# EAGLE design MOL-v1.4 (EAGLE 8.2.2)
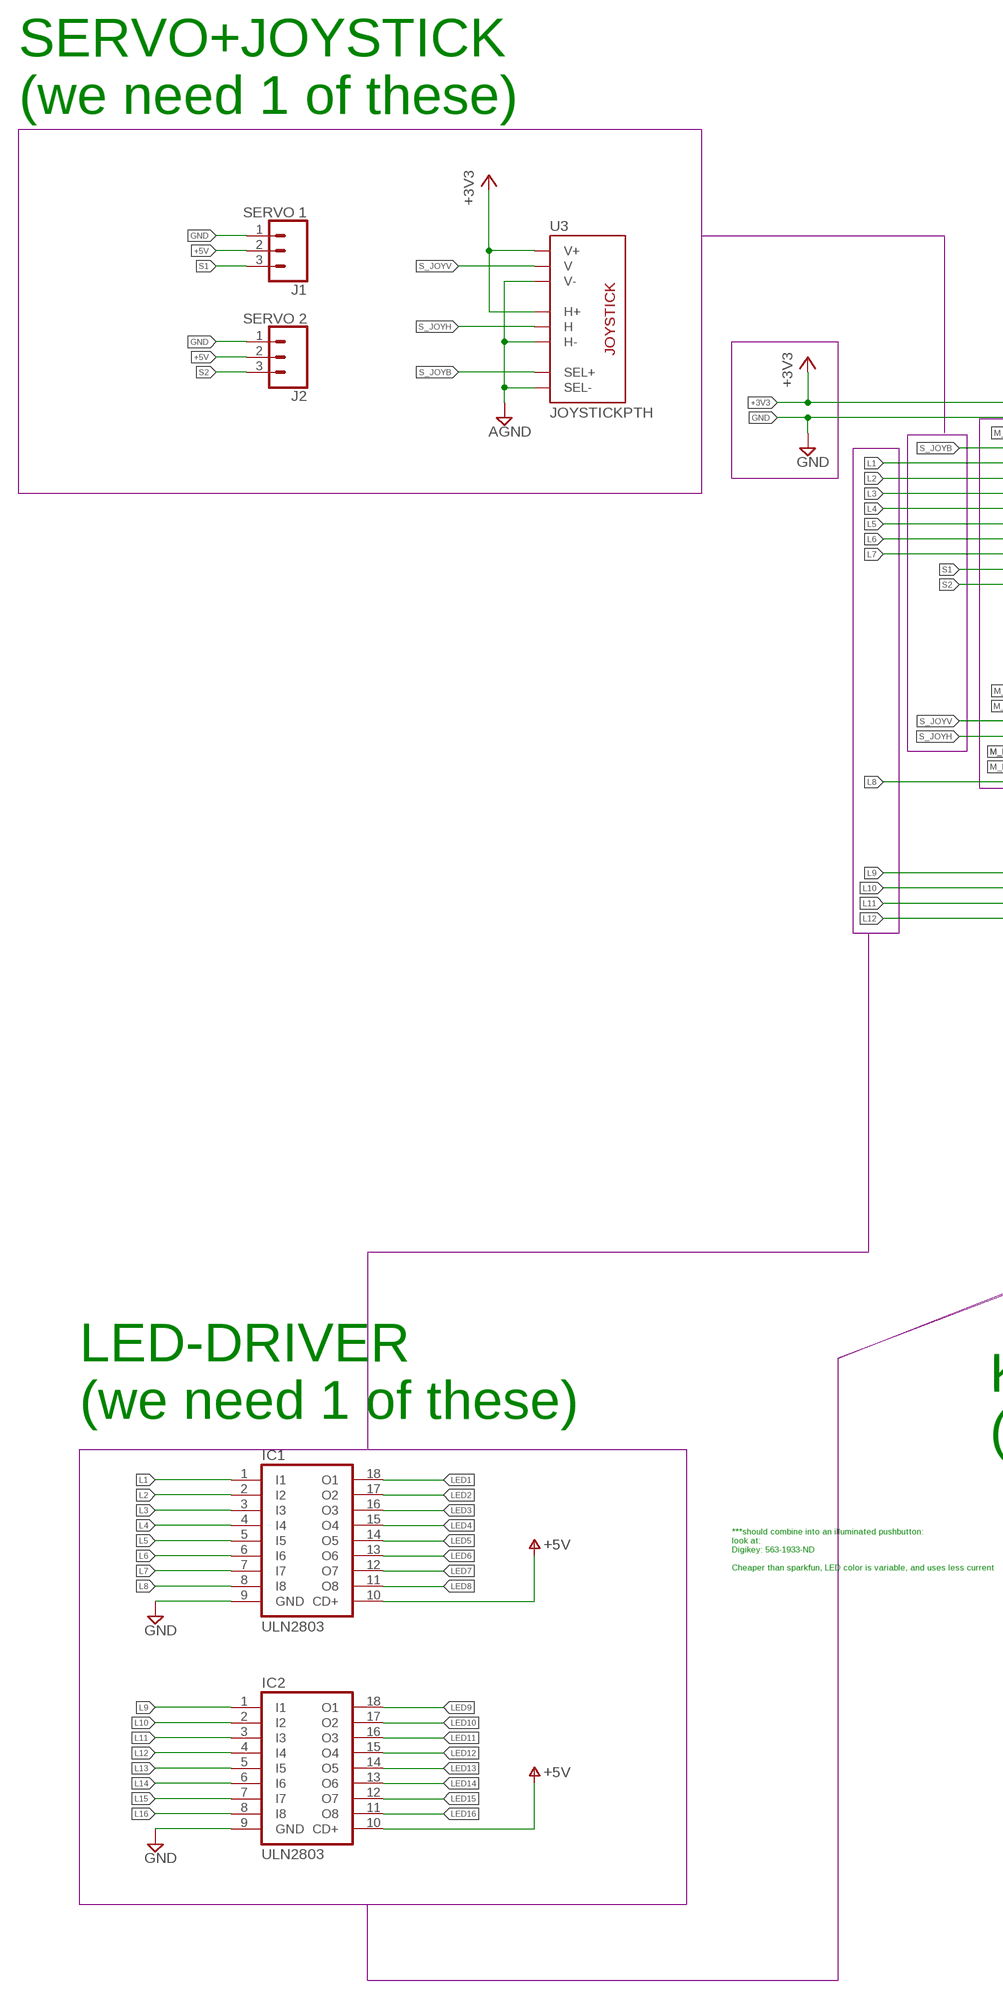
[diagram p0: schematic, sheet 1, part 1 of 2]
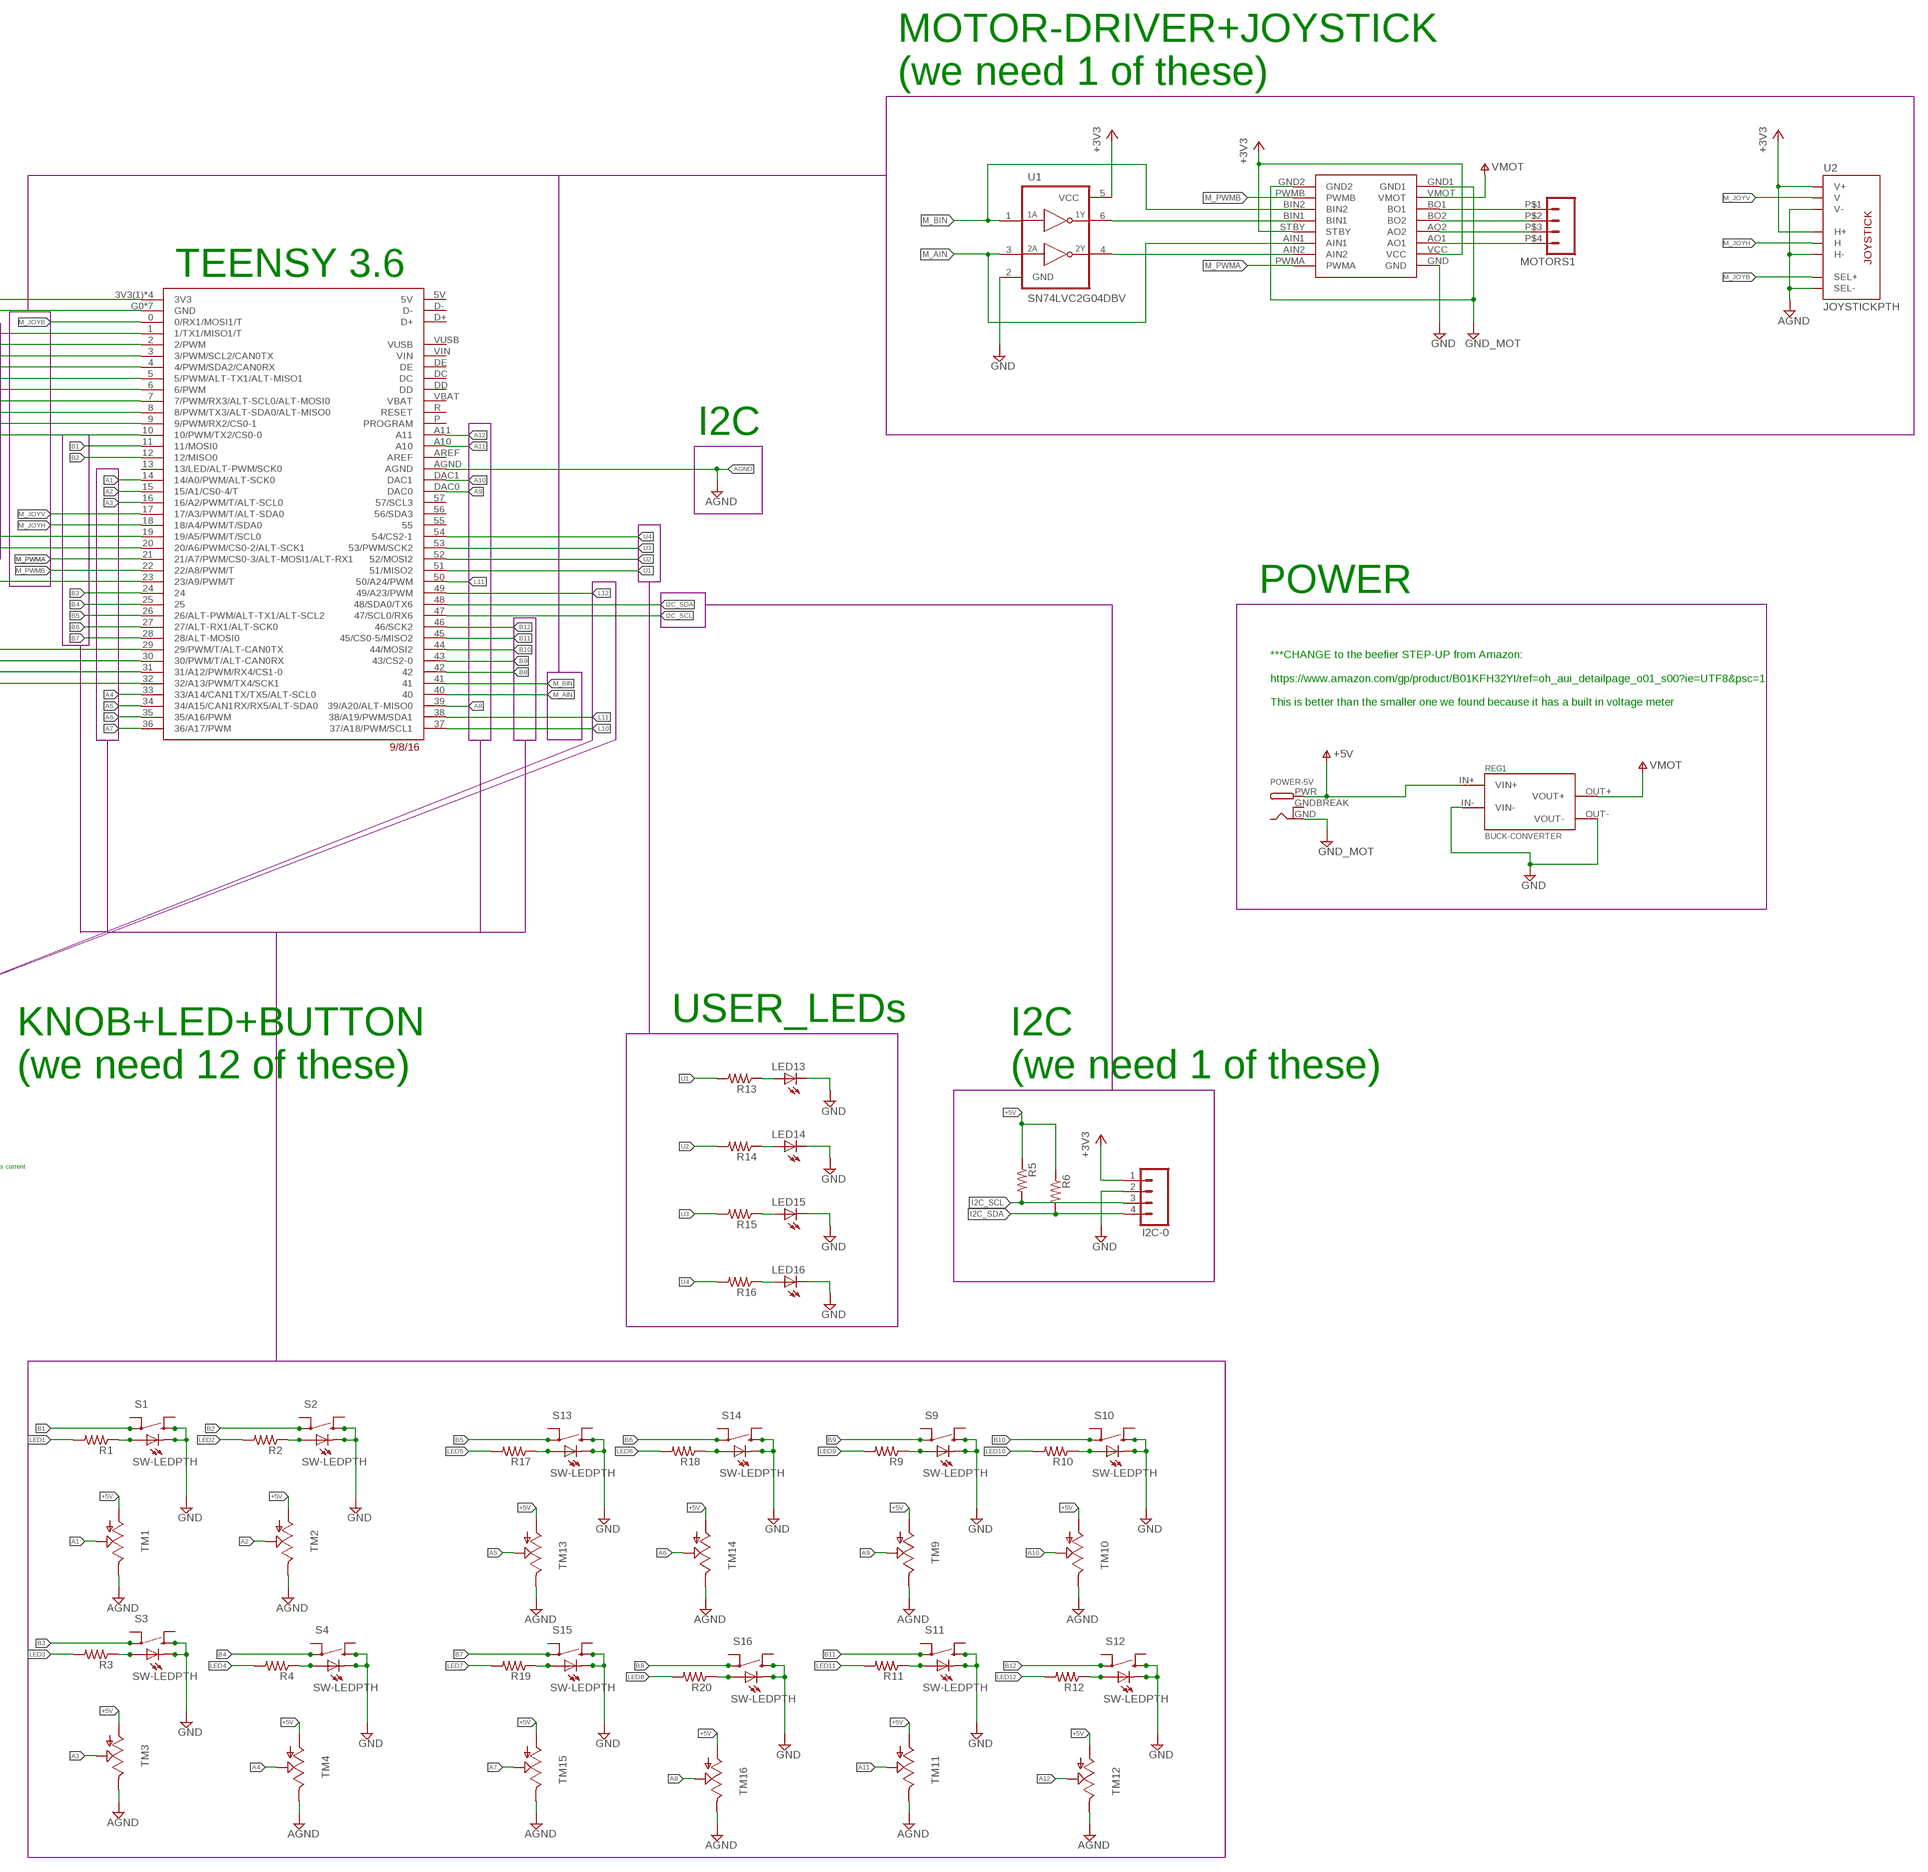
[diagram p1: schematic, sheet 1, part 2 of 2]

## Parts
I2C-0  M04LOCK  [1X04_LOCK]
IC1  ULN2803  ULN2803A  [DIL18]
IC2  ULN2803  ULN2803A  [DIL18]
J1  SERVO 1  CONN_03LOCK  [1X03_LOCK]
J2  SERVO 2  CONN_03LOCK  [1X03_LOCK]
LED13  LED3MM  [LED3MM]
LED14  LED3MM  [LED3MM]
LED15  LED3MM  [LED3MM]
LED16  LED3MM  [LED3MM]
MOTORS1  M04  [SPRINGTERMINAL-2.54MM-4]
POWER-5V  DCBARRELPTH  [DCJACK_2MM_PTH]
R1  R-US_R0603  [R0603]
R2  R-US_R0603  [R0603]
R3  R-US_R0603  [R0603]
R4  R-US_R0603  [R0603]
R5  R-US_R0603  [R0603]
R6  R-US_R0603  [R0603]
R9  R-US_R0603  [R0603]
R10  R-US_R0603  [R0603]
R11  R-US_R0603  [R0603]
R12  R-US_R0603  [R0603]
R13  R-US_R0603  [R0603]
R14  R-US_R0603  [R0603]
R15  R-US_R0603  [R0603]
R16  R-US_R0603  [R0603]
R17  R-US_R0603  [R0603]
R18  R-US_R0603  [R0603]
R19  R-US_R0603  [R0603]
R20  R-US_R0603  [R0603]
REG1  BUCK-CONVERTER  [BUCK-CONVERTER]
S1  SW-LEDPTH  [TR2-SWITCH-MOMENTARY-LED]
S2  SW-LEDPTH  [TR2-SWITCH-MOMENTARY-LED]
S3  SW-LEDPTH  [TR2-SWITCH-MOMENTARY-LED]
S4  SW-LEDPTH  [TR2-SWITCH-MOMENTARY-LED]
S9  SW-LEDPTH  [TR2-SWITCH-MOMENTARY-LED]
S10  SW-LEDPTH  [TR2-SWITCH-MOMENTARY-LED]
S11  SW-LEDPTH  [TR2-SWITCH-MOMENTARY-LED]
S12  SW-LEDPTH  [TR2-SWITCH-MOMENTARY-LED]
S13  SW-LEDPTH  [TR2-SWITCH-MOMENTARY-LED]
S14  SW-LEDPTH  [TR2-SWITCH-MOMENTARY-LED]
S15  SW-LEDPTH  [TR2-SWITCH-MOMENTARY-LED]
S16  SW-LEDPTH  [TR2-SWITCH-MOMENTARY-LED]
TM1  TRIM  [TRIM-PCB-9MM]
TM2  TRIM  [TRIM-PCB-9MM]
TM3  TRIM  [TRIM-PCB-9MM]
TM4  TRIM  [TRIM-PCB-9MM]
TM9  TRIM  [TRIM-PCB-9MM]
TM10  TRIM  [TRIM-PCB-9MM]
TM11  TRIM  [TRIM-PCB-9MM]
TM12  TRIM  [TRIM-PCB-9MM]
TM13  TRIM  [TRIM-PCB-9MM]
TM14  TRIM  [TRIM-PCB-9MM]
TM15  TRIM  [TRIM-PCB-9MM]
TM16  TRIM  [TRIM-PCB-9MM]
U1  SN74LVC2G04DBV  [SOT23-6]
U2  JOYSTICKPTH  [JOYSTICK]
U3  JOYSTICKPTH  [JOYSTICK]
U$1  TEENSY3_6--ALLPINS  [T36]
U$7  POLOLU_TB6612FNG  [POLOLU_TB6612FNG]

## Nets
+3V3: I2C-0.1 U1.5(VCC) U2.H1(H+) U2.V1(V+) U3.H1(H+) U3.V1(V+) U$1.3V3(1)(3V3) U$1.3V3(2)(3V3) U$1.3V3(3)(3V3) U$1.3V3(4)(3V3) U$7.STBY U$7.VCC
+5V [Power]: IC1.10(CD+) IC2.10(CD+) J1.2 J2.2 POWER-5V.PWR R5.1 R6.1 REG1.IN+(VIN+) TM1.1(A) TM2.1(A) TM3.1(A) TM4.1(A) TM9.1(A) TM10.1(A) TM11.1(A) TM12.1(A) TM13.1(A) TM14.1(A) TM15.1(A) TM16.1(A) ; supply symbol labelled V+
A1: TM1.2(S) U$1.14(14/A0/PWM/ALT-SCK0)
A2: TM2.2(S) U$1.15(15/A1/CS0-4/T)
A3: TM3.2(S) U$1.16(16/A2/PWM/T/ALT-SCL0)
A4: TM4.2(S) U$1.33(33/A14/CAN1TX/TX5/ALT-SCL0)
A5: TM13.2(S) U$1.34(34/A15/CAN1RX/RX5/ALT-SDA0)
A6: TM14.2(S) U$1.35(35/A16/PWM)
A7: TM15.2(S) U$1.36(36/A17/PWM)
A8: TM16.2(S) U$1.39(39/A20/ALT-MISO0)
A9: TM9.2(S) U$1.DAC0
A10: TM10.2(S) U$1.DAC1
A11: TM11.2(S) U$1.A10
A12: TM12.2(S) U$1.A11
AGND: TM1.3(E) TM2.3(E) TM3.3(E) TM4.3(E) TM9.3(E) TM10.3(E) TM11.3(E) TM12.3(E) TM13.3(E) TM14.3(E) TM15.3(E) TM16.3(E) U2.B2A(SEL-) U2.H3(H-) U2.V3(V-) U3.B2A(SEL-) U3.H3(H-) U3.V3(V-) U$1.AGND
B1: S1.3 U$1.11(11/MOSI0)
B2: S2.3 U$1.12(12/MISO0)
B3: S3.3 U$1.24
B4: S4.3 U$1.25
B5: S13.3 U$1.26(26/ALT-PWM/ALT-TX1/ALT-SCL2)
B6: S14.3 U$1.27(27/ALT-RX1/ALT-SCK0)
B7: S15.3 U$1.28(28/ALT-MOSI0)
B8: S16.3 U$1.42
B9: S9.3 U$1.43(43/CS2-0)
B10: S10.3 U$1.44(44/MOSI2)
B11: S11.3 U$1.45(45/CS0-5/MISO2)
B12: S12.3 U$1.46(46/SCK2)
GND: I2C-0.2 IC1.9(GND) IC2.9(GND) J1.1 J2.1 LED13.K(C) LED14.K(C) LED15.K(C) LED16.K(C) REG1.IN-(VIN-) REG1.OUT-(VOUT-) S1.1 S1.C S2.1 S2.C S3.1 S3.C S4.1 S4.C S9.1 S9.C S10.1 S10.C S11.1 S11.C S12.1 S12.C S13.1 S13.C S14.1 S14.C S15.1 S15.C S16.1 S16.C U1.2(GND) U$1.G0(GND) U$1.G1(GND) U$1.G2(GND) U$1.G3(GND) U$1.G4(GND) U$1.G5(GND) U$1.G6(GND) U$7.GND
GND_MOT [Power]: POWER-5V.GND U$7.GND1 U$7.GND2
I2C_SCL: I2C-0.3 R5.2 U$1.47(47/SCL0/RX6)
I2C_SDA: I2C-0.4 R6.2 U$1.48(48/SDA0/TX6)
L1: IC1.1(I1) U$1.2(2/PWM)
L2: IC1.2(I2) U$1.3(3/PWM/SCL2/CAN0TX)
L3: IC1.3(I3) U$1.4(4/PWM/SDA2/CAN0RX)
L4: IC1.4(I4) U$1.5(5/PWM/ALT-TX1/ALT-MISO1)
L5: IC1.5(I5) U$1.6(6/PWM)
L6: IC1.6(I6) U$1.7(7/PWM/RX3/ALT-SCL0/ALT-MOSI0)
L7: IC1.7(I7) U$1.8(8/PWM/TX3/ALT-SDA0/ALT-MISO0)
L8: IC1.8(I8) U$1.23(23/A9/PWM/T)
L9: IC2.1(I1) U$1.29(29/PWM/T/ALT-CAN0TX)
L10: IC2.2(I2) U$1.30(30/PWM/T/ALT-CAN0RX) U$1.37(37/A18/PWM/SCL1)
L11: IC2.3(I3) U$1.31(31/A12/PWM/RX4/CS1-0) U$1.38(38/A19/PWM/SDA1) U$1.50(50/A24/PWM)
L12: IC2.4(I4) U$1.32(32/A13/PWM/TX4/SCK1) U$1.49(49/A23/PWM)
L13: IC2.5(I5)
L14: IC2.6(I6)
L15: IC2.7(I7)
L16: IC2.8(I8)
LED1: IC1.18(O1) R1.2
LED2: IC1.17(O2) R2.2
LED3: IC1.16(O3) R3.2
LED4: IC1.15(O4) R4.2
LED5: IC1.14(O5) R17.2
LED6: IC1.13(O6) R18.2
LED7: IC1.12(O7) R19.2
LED8: IC1.11(O8) R20.2
LED9: IC2.18(O1) R9.2
LED10: IC2.17(O2) R10.2
LED11: IC2.16(O3) R11.2
LED12: IC2.15(O4) R12.2
LED13: IC2.14(O5)
LED14: IC2.13(O6)
LED15: IC2.12(O7)
LED16: IC2.11(O8)
M_AIN: U1.3(2A) U$1.40 U$7.AIN1
M_BIN: U1.1(1A) U$1.41 U$7.BIN2
M_JOYB: U2.B1A(SEL+) U$1.0(0/RX1/MOSI1/T)
M_JOYH: U2.H2(H) U$1.18(18/A4/PWM/T/SDA0)
M_JOYV: U2.V2(V) U$1.17(17/A3/PWM/T/ALT-SDA0)
M_PWMA: U$1.21(21/A7/PWM/CS0-3/ALT-MOSI1/ALT-RX1) U$7.PWMA
M_PWMB: U$1.22(22/A8/PWM/T) U$7.PWMB
N$1: R1.1 S1.A
N$2: LED13.A R13.1
N$3: LED14.A R14.1
N$4: LED15.A R15.1
N$5: U1.6(1Y) U$7.BIN1
N$6: U1.4(2Y) U$7.AIN2
N$7: LED16.A R16.1
N$8: R2.1 S2.A
N$9: R3.1 S3.A
N$10: R4.1 S4.A
N$15: R9.1 S9.A
N$16: R10.1 S10.A
N$17: R11.1 S11.A
N$18: R12.1 S12.A
N$19: R17.1 S13.A
N$20: R18.1 S14.A
N$21: R19.1 S15.A
N$22: R20.1 S16.A
N$45 [Power]: MOTORS1.P$1 U$7.BO1
N$46 [Power]: MOTORS1.P$2 U$7.BO2
N$52 [Power]: MOTORS1.P$3 U$7.AO2
N$54 [Power]: MOTORS1.P$4 U$7.AO1
S1: J1.3 U$1.9(9/PWM/RX2/CS0-1)
S2: J2.3 U$1.10(10/PWM/TX2/CS0-0)
S_JOYB: U3.B1A(SEL+) U$1.1(1/TX1/MISO1/T)
S_JOYH: U3.H2(H) U$1.20(20/A6/PWM/CS0-2/ALT-SCK1)
S_JOYV: U3.V2(V) U$1.19(19/A5/PWM/T/SCL0)
U1: R13.2 U$1.51(51/MISO2)
U2: R14.2 U$1.52(52/MOSI2)
U3: R15.2 U$1.53(53/PWM/SCK2)
U4: R16.2 U$1.54(54/CS2-1)
VMOT [Power]: REG1.OUT+(VOUT+) U$7.VMOT ; supply symbol labelled V+
Unconnected: S1.2 S1.4 S2.2 S2.4 S3.2 S3.4 S4.2 S4.4 S9.2 S9.4 S10.2 S10.4 S11.2 S11.4 S12.2 S12.4 S13.2 S13.4 S14.2 S14.4 S15.2 S15.4 S16.2 S16.4 U$1.5V U$1.13(13/LED/ALT-PWM/SCK0) U$1.55 U$1.56(56/SDA3) U$1.57(57/SCL3) U$1.AREF U$1.D+ U$1.D- U$1.DC U$1.DD U$1.DE U$1.P(PROGRAM) U$1.R(RESET) U$1.VBAT U$1.VIN U$1.VUSB

## Notes on the sheet
- SERVO+JOYSTICK
  (we need 1 of these)
- MOTOR-DRIVER+JOYSTICK
  (we need 1 of these)
- TEENSY 3.6
- I2C
- POWER
- ***CHANGE to the beefier STEP-UP from Amazon:
  
  https://www.amazon.com/gp/product/B01KFH32YI/ref=oh_aui_detailpage_o01_s00?ie=UTF8&psc=1
  
  This is better than the smaller one we found because it has a built in voltage meter
- USER_LEDs
- LED-DRIVER
  (we need 1 of these)
- KNOB+LED+BUTTON
  (we need 12 of these)
- I2C
  (we need 1 of these)
- ***should combine into an illuminated pushbutton:
  look at:
  Digikey: 563-1933-ND
  
  Cheaper than sparkfun, LED color is variable, and uses less current

## Power pins joined to a net without a drawn wire
GNDBREAK: POWER-5V.GNDBREAK

## Library data of the parts
I2C-0 MOTORS1 = CMU-ArtFab:M04: Header 4 Standard 4-pin 0.1" header. Use with straight break away headers (SKU : PRT-00116), right angle break away headers (PRT-00553), swiss pins (PRT-00743), machine pins (PRT-00117), and female headers (PRT-00115). Molex polarized connector foot print use with SKU : PRT-08231 with associated crimp pins and housings. 1MM SMD Version SKU: PRT-10208
IC1 IC2 = uln-udn:ULN2803A: DRIVER ARRAY
J1 J2 = SparkFun-Connectors:CONN_03: Multi connection point. Often used as Generic Header-pin footprint for 0.1 inch spaced/style header connections On any of the 0.1 inch spaced packages, you can populate with these: Break Away Headers - Straight <https://www.sparkfun.com/products/116> (PRT-00116) Break Away Male Headers - Right Angle <https://www.sparkfun.com/products/553> (PRT-00553) Female Headers <https://www.sparkfun.com/products/115> (PRT-00115) Break Away Headers - Machine Pin <https://www.sparkfun.com/products/117> (PRT-00117) Break Away Female Headers - Swiss Machine Pin <https://www.sparkfun.com/products/743> (PRT-00743) Stackable Header - 3 Pin (Female, 0.1") <https://www.sparkfun.com/products/13875> (PRT-13875) For SCREWTERMINALS and SPRING TERMINALS visit here: Screw Terimnals on SparkFun.com <https://www.sparkfun.com/search/results?term=Screw+Terminals> (5mm/3.5mm/2.54mm spacing) This device is also useful as a general connection point to wire up your design to another part of your project. Our various solder wires solder well into these plated through hole pads. Hook-Up Wire - Assortment (Stranded, 22 AWG) <https://www.sparkfun.com/products/11375> (PRT-11375) Hook-Up Wire - Assortment (Solid Core, 22 AWG) <https://www.sparkfun.com/products/11367> (PRT-11367) View the entire wire category on our website here <https://www.sparkfun.com/categories/141> Special notes: Molex polarized connector foot print use with SKU : PRT-08232 with associated crimp pins and housings.
LED13-LED16 = led:LED: LED OSRAM: - CHIPLED LG R971, LG N971, LY N971, LG Q971, LY Q971, LO R971, LY R971 LH N974, LH R974 LS Q976, LO Q976, LY Q976 LO Q996 - Hyper CHIPLED LW Q18S LB Q993, LB Q99A, LB R99A - SideLED LS A670, LO A670, LY A670, LG A670, LP A670 LB A673, LV A673, LT A673, LW A673 LH A674 LY A675 LS A676, LA A676, LO A676, LY A676, LW A676 LS A679, LY A679, LG A679 - Hyper Micro SIDELED® LS Y876, LA Y876, LO Y876, LY Y876 LT Y87S - SmartLED LW L88C, LW L88S LB L89C, LB L89S, LG L890 LS L89K, LO L89K, LY L89K LS L896, LA L896, LO L896, LY L896 - TOPLED LS T670, LO T670, LY T670, LG T670, LP T670 LSG T670, LSP T670, LSY T670, LOP T670, LYG T670 LG T671, LOG T671, LSG T671 LB T673, LV T673, LT T673, LW T673 LH T674 LS T676, LA T676, LO T676, LY T676, LB T676, LH T676, LSB T676, LW T676 LB T67C, LV T67C, LT T67C, LS T67K, LO T67K, LY T67K, LW E67C LS E67B, LA E67B, LO E67B, LY E67B, LB E67C, LV E67C, LT E67C LW T67C LS T679, LY T679, LG T679 LS T770, LO T770, LY T770, LG T770, LP T770 LB T773, LV T773, LT T773, LW T773 LH T774 LS E675, LA E675, LY E675, LS T675 LS T776, LA T776, LO T776, LY T776, LB T776 LHGB T686 LT T68C, LB T68C - Hyper Mini TOPLED® LB M676 - Mini TOPLED Santana® LG M470 LS M47K, LO M47K, LY M47K Source: http://www.osram.convergy.de LUXEON: - LUMILED® LXK2-PW12-R00, LXK2-PW12-S00, LXK2-PW14-U00, LXK2-PW14-V00 LXK2-PM12-R00, LXK2-PM12-S00, LXK2-PM14-U00 LXK2-PE12-Q00, LXK2-PE12-R00, LXK2-PE12-S00, LXK2-PE14-T00, LXK2-PE14-U00 LXK2-PB12-K00, LXK2-PB12-L00, LXK2-PB12-M00, LXK2-PB14-N00, LXK2-PB14-P00, LXK2-PB14-Q00 LXK2-PR12-L00, LXK2-PR12-M00, LXK2-PR14-Q00, LXK2-PR14-R00 LXK2-PD12-Q00, LXK2-PD12-R00, LXK2-PD12-S00 LXK2-PH12-R00, LXK2-PH12-S00 LXK2-PL12-P00, LXK2-PL12-Q00, LXK2-PL12-R00 Source: www.luxeon.com KINGBRIGHT: KA-3528ASYC Source: www.kingbright.com
POWER-5V = adafruit:DCBARREL: 2.0mm DC Barrel Jack DCJACK_2MM_PTH - Through Hole Jack (4UConnector: 05537)
R1-R6 R9-R20 = CMU-ArtFab:R-US_: RESISTOR, American symbol
REG1 = Daniel:BUCK-CONVERTER
S1-S4 S9-S16 = Daniel:SW-LED: SWITCH PUSH SPST-NO 10MA 12V
TM1-TM4 TM9-TM16 = Daniel:TRIM
U1 = 74LV:SN74LVC2G04: DUAL INVERTER GATE
U2 U3 = adafruit:JOYSTICK: Thumb Joystick Joystick commonly found in PS2 controllers. Two pots and a select switch. Adapted from Sparkfun Library (but for more common 6mm switch sticks)
U$1 = Teensy_3_6:TEENSY3_6--ALLPINS
U$7 = CMU-ArtFab:POLOLU_TB6612FNG

## Net classes
2 Power: width 0.508 mm, clearance 0.152 mm

## Board
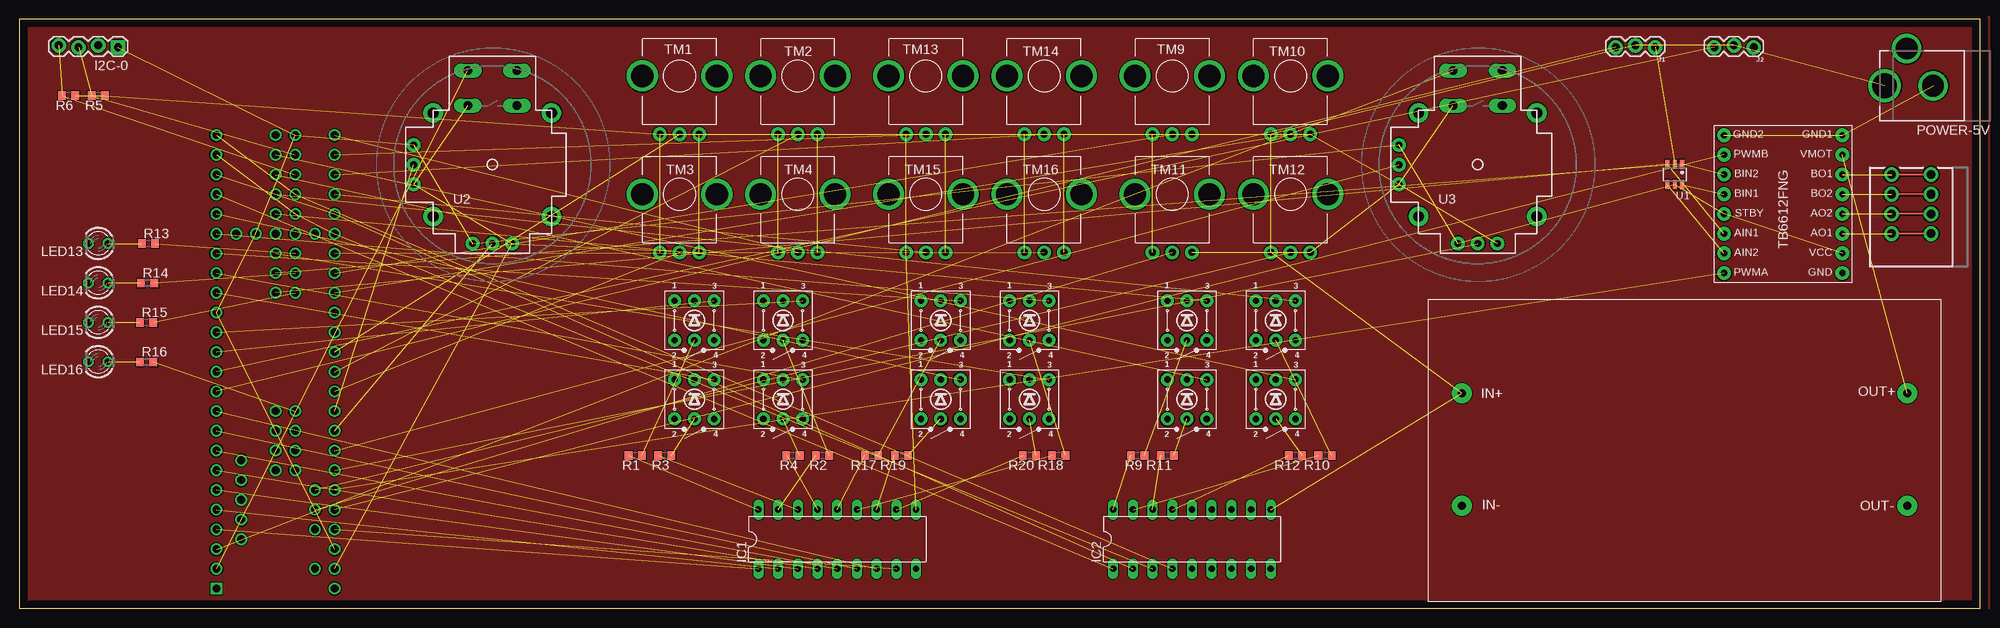
[diagram p2: board, top side]
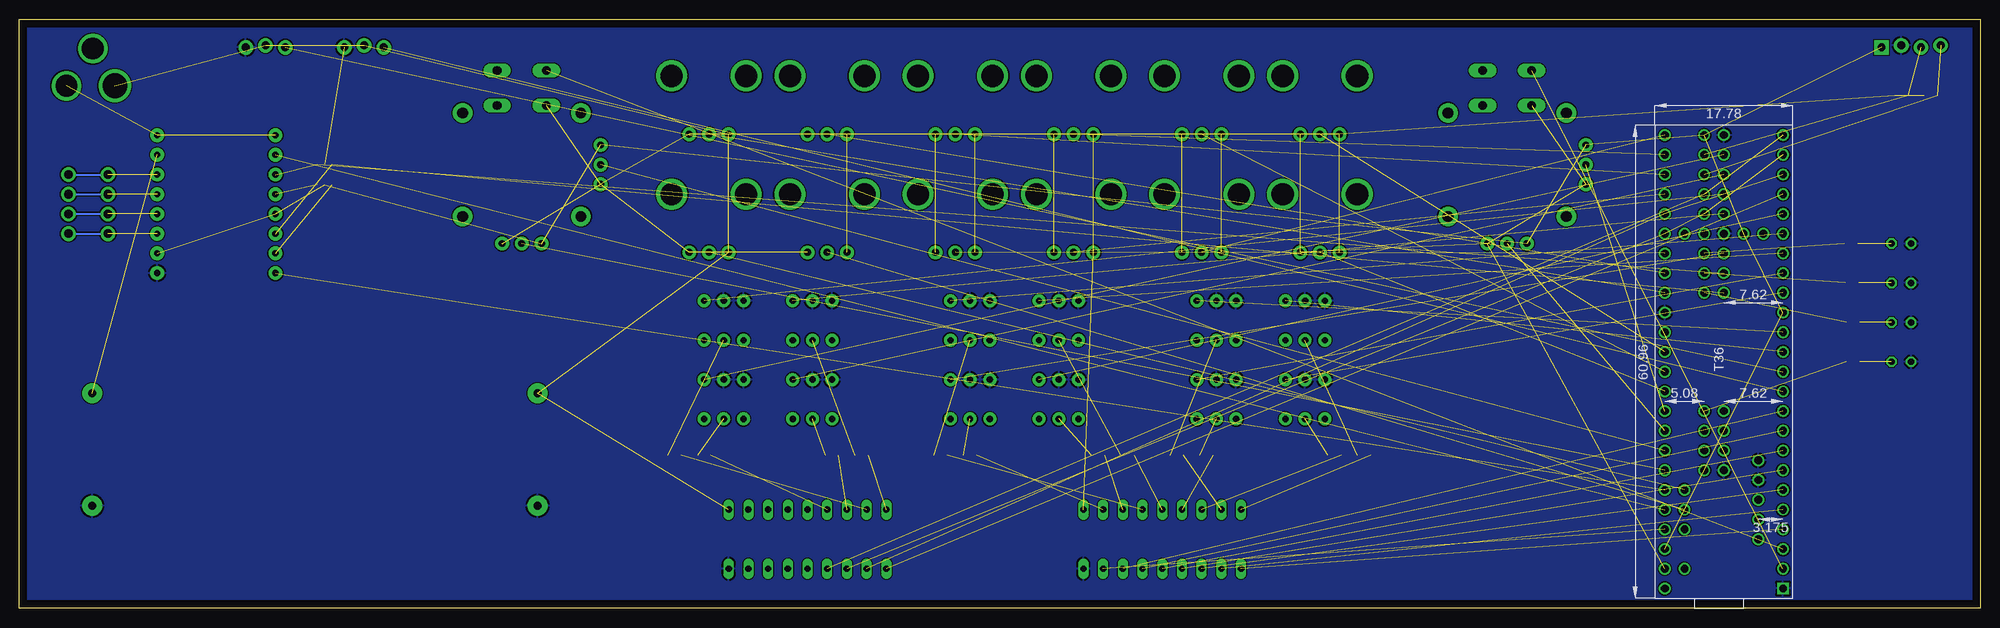
[diagram p3: board, bottom side, seen from below]

Size 252.71 x 75.87 mm. Coordinates in mm from the lower left corner, seen from the top.
Outline: 0,0 252.71,0 252.71,75.87 0,75.87 0,0
Copper layers (1*16): Top 0.035mm / dielectric 1.5mm / Bottom 0.035mm
Design rules "default": minimum track width 6mil, minimum drill 0.35mm, track to track 6mil, track to pad 6mil, pad to pad 6mil, via to via 6mil, smd to smd 6mil, copper to edge 40mil, drill to drill 6mil, minimum pad ring 10mil, minimum via ring 8mil, stop-mask expansion 4mil, vias tented up to drill 0mil, thermal gap 10mil

### Footprints (pad centres in the part's own frame; a part is rotated, then mirrored left to right if it is on the bottom)
1X04_LOCK = drill 1.016 pad 1.88 square: 1 0,0.127 | drill 1.016 pad 1.88: 2 2.54,-0.127; 3 5.08,0.127; 4 7.62,-0.127
DIL18 = drill 0.813 long: 1 -10.16,-3.81; 2 -7.62,-3.81; 3 -5.08,-3.81; 4 -2.54,-3.81; 5 0,-3.81; 6 2.54,-3.81; 7 5.08,-3.81; 8 7.62,-3.81; 9 10.16,-3.81; 10 10.16,3.81; 11 7.62,3.81; 12 5.08,3.81; 13 2.54,3.81; 14 0,3.81; 15 -2.54,3.81; 16 -5.08,3.81; 17 -7.62,3.81; 18 -10.16,3.81
1X03_LOCK = drill 1.016 pad 1.88: 1 0,0.127; 2 2.54,-0.127; 3 5.08,0.127
LED3MM = drill 0.813 octagon: A -1.27,0; K 1.27,0
SPRINGTERMINAL-2.54MM-4 = drill 1.1 pad 1.9: 1 7.62,-2.54; 2 5.08,-2.54; 3 2.54,-2.54; 4 0,-2.54; P$1 7.62,2.54; P$2 5.08,2.54; P$3 2.54,2.54; P$4 0,2.54
DCJACK_2MM_PTH = drill 2.8: GND 0,7.35; GNDBREAK 4.8,10.75 | drill 3.2: PWR 0,13.6
R0603 = smd 1 x 1.1: 1 -0.85,0; 2 0.85,0
BUCK-CONVERTER = drill 1 pad 2.54: IN+ -28.702,7.366; IN- -28.702,-7.112; OUT+ 28.702,7.366; OUT- 28.702,-7.112 | drill 0.6 square: P$1 28.702,-7.112; P$2 28.702,7.366; P$6 -28.702,7.366
TR2-SWITCH-MOMENTARY-LED = drill 0.8 pad 1.676: 1 2.54,-2.54; 2 2.54,2.54; 3 -2.54,-2.54; 4 -2.54,2.54; A 0,2.54; C 0,-2.54
TRIM-PCB-9MM = drill 0.9 pad 1.778: 1 -2.54,-7.5; 2 0,-7.5; 3 2.54,-7.5 | drill 2.845 pad 4: 5 -4.8,0; 6 -4.8,0; M1 -4.8,0; M2 4.8,0
SOT23-6 = smd 0.55 x 1.2: 1 -0.95,-1.3; 2 0,-1.3; 3 0.95,-1.3; 4 0.95,1.3; 5 0,1.3; 6 -0.95,1.3
JOYSTICK = drill 1.1 pad 1.778 long: B1A -3.175,12.12; B1B 3.175,12.12; B2A -3.175,7.62; B2B 3.175,7.62 | drill 0.889 pad 1.778: H1 -2.54,-10.16; H2 0,-10.16; H3 2.54,-10.16; V1 -10.16,2.54; V2 -10.16,0; V3 -10.16,-2.54 | drill 1.397 pad 2.54: MOUNT1 -7.62,6.668; MOUNT2 -7.62,-6.668; MOUNT3 7.62,-6.668; MOUNT4 7.62,6.668
T36 = drill 1: 0 -15.24,-5.08; 1 -12.7,-5.08; 2 -10.16,-5.08; 3 -7.62,-5.08; 3V3(1) 17.78,-5.08; 3V3(2) 27.94,0; 3V3(3) -12.7,10.16; 3V3(4) 40.64,5.08; 4 -5.08,-5.08; 5 -2.54,-5.08; 5V -11.43,-1.905; 6 0,-5.08; 7 2.54,-5.08; 8 5.08,-5.08; 9 7.62,-5.08; 10 10.16,-5.08; 11 12.7,-5.08; 12 15.24,-5.08; 13 15.24,10.16; 14 12.7,10.16; 15 10.16,10.16; 16 7.62,10.16; 17 5.08,10.16; 18 2.54,10.16; 19 0,10.16; 20 -2.54,10.16; 21 -5.08,10.16; 22 -7.62,10.16; 23 -10.16,10.16; 24 20.32,-5.08; 25 22.86,-5.08; 26 25.4,-5.08; 27 27.94,-5.08; 28 30.48,-5.08; 29 33.02,-5.08; 30 35.56,-5.08; 31 38.1,-5.08; 32 40.64,-5.08; 33 40.64,10.16; 34 38.1,10.16; 35 35.56,10.16; 36 33.02,10.16; 37 30.48,10.16; 38 27.94,10.16; 39 25.4,10.16; 40 20.32,2.54; 41 22.86,2.54; 42 25.4,2.54; 43 30.48,2.54; 44 33.02,2.54; 45 35.56,2.54; 46 38.1,2.54; 47 38.1,5.08; 48 35.56,5.08; 49 33.02,5.08; 50 30.48,5.08; 51 25.4,5.08; 52 22.86,5.08; 53 20.32,5.08; 54 5.08,5.08; 55 2.54,5.08; 56 0,5.08; 57 -2.54,5.08; A10 -7.62,7.62; A11 -5.08,7.62; AGND -15.24,10.16; AREF -10.16,7.62; D+ -6.35,-1.905; D- -8.89,-1.905; DAC0 22.86,10.16; DAC1 20.32,10.16; DC 2.54,2.54; DD 5.08,2.54; DE 0,2.54; G1 27.94,2.54; G2 17.78,10.16; G3 40.64,2.54; G4 -3.81,-1.905; G5 -1.27,-1.905; G6 -2.54,2.54; P 27.94,5.08; R 27.94,7.62; VBAT 27.94,-2.54; VIN -17.78,10.16; VUSB -15.24,7.62 | drill 1 square: G0 -17.78,-5.08
POLOLU_TB6612FNG = drill 0.8 pad 1.778: AIN1 7.62,3.81; AIN2 7.62,6.35; AO1 -7.62,3.81; AO2 -7.62,1.27; BIN1 7.62,-1.27; BIN2 7.62,-3.81; BO1 -7.62,-3.81; BO2 -7.62,-1.27; GND -7.62,8.89; GND1 -7.62,-8.89; GND2 7.62,-8.89; PWMA 7.62,8.89; PWMB 7.62,-6.35; STBY 7.62,1.27; VCC -7.62,6.35; VMOT -7.62,-6.35

### Placement (x,y rotation side)
I2C-0  12.7,72.39 180 top
IC1  105.41,8.89 0 top
IC2  151.13,8.89 0 top
J1  210.82,72.39 180 top
J2  223.52,72.39 180 top
LED13  10.16,46.99 180 top
LED14  10.16,41.91 180 top
LED15  10.16,36.83 180 top
LED16  10.16,31.75 180 top
MOTORS1  243.84,48.26 90 top
POWER-5V  254,67.31 90 top
R1  79.38,19.68 180 top
R2  103.5,19.68 180 top
R3  83.19,19.68 180 top
R4  99.69,19.68 180 top
R5  10.16,66.04 180 top
R6  6.35,66.04 180 top
R9  144.15,19.68 180 top
R10  168.28,19.68 180 top
R11  147.96,19.68 180 top
R12  164.47,19.68 180 top
R13  16.64,46.99 0 top
R14  16.51,41.91 0 top
R15  16.38,36.83 0 top
R16  16.38,31.75 0 top
R17  109.86,19.68 180 top
R18  133.99,19.68 180 top
R19  113.67,19.68 180 top
R20  130.18,19.68 180 top
REG1  214.63,20.32 0 top
S1  87,37.08 180 top
S2  98.42,37.08 180 top
S3  87,26.92 180 top
S4  98.42,26.92 180 top
S9  150.5,37.08 180 top
S10  161.93,37.08 180 top
S11  150.5,26.92 180 top
S12  161.93,26.92 180 top
S13  118.75,37.08 180 top
S14  130.18,37.08 180 top
S15  118.75,26.92 180 top
S16  130.18,26.92 180 top
TM1  85.09,68.58 0 top
TM2  100.33,68.58 0 top
TM3  85.09,53.34 0 top
TM4  100.33,53.34 0 top
TM9  148.59,68.58 0 top
TM10  163.83,68.58 0 top
TM11  148.59,53.34 0 top
TM12  163.83,53.34 0 top
TM13  116.84,68.58 0 top
TM14  132.08,68.58 0 top
TM15  116.84,53.34 0 top
TM16  132.08,53.34 0 top
U1  213.36,55.88 180 top
U2  60.96,57.15 0 top
U3  187.96,57.15 0 top
U$1  30.48,20.32 90 bottom
U$7  227.33,52.07 180 top

### Tracks (layer width: path | path; a pad name or v marks a point on that pad's centre or on a via)
+3V3  (11 unrouted)
+5V  (19 unrouted)
A1  (1 unrouted)
A2  (1 unrouted)
A3  (1 unrouted)
A4  (1 unrouted)
A5  (1 unrouted)
A6  (1 unrouted)
A7  (1 unrouted)
A8  (1 unrouted)
A9  (1 unrouted)
A10  (1 unrouted)
A11  (1 unrouted)
A12  (1 unrouted)
AGND  (18 unrouted)
B1  (1 unrouted)
B2  (1 unrouted)
B3  (1 unrouted)
B4  (1 unrouted)
B5  (1 unrouted)
B6  (1 unrouted)
B7  (1 unrouted)
B8  (1 unrouted)
B9  (1 unrouted)
B10  (1 unrouted)
B11  (1 unrouted)
B12  (1 unrouted)
GND  (1 unrouted)
  pour Bottom: 0,76.2 0,0 254,0 254,76.2
GND_MOT  (2 unrouted)
I2C_SCL  (2 unrouted)
I2C_SDA  (2 unrouted)
L1  (1 unrouted)
L2  (1 unrouted)
L3  (1 unrouted)
L4  (1 unrouted)
L5  (1 unrouted)
L6  (1 unrouted)
L7  (1 unrouted)
L8  (1 unrouted)
L9  (1 unrouted)
L10  (2 unrouted)
L11  (3 unrouted)
L12  (2 unrouted)
LED1  (1 unrouted)
LED2  (1 unrouted)
LED3  (1 unrouted)
LED4  (1 unrouted)
LED5  (1 unrouted)
LED6  (1 unrouted)
LED7  (1 unrouted)
LED8  (1 unrouted)
LED9  (1 unrouted)
LED10  (1 unrouted)
LED11  (1 unrouted)
LED12  (1 unrouted)
M_AIN  (2 unrouted)
M_BIN  (2 unrouted)
M_JOYB  (1 unrouted)
M_JOYH  (1 unrouted)
M_JOYV  (1 unrouted)
M_PWMA  (1 unrouted)
M_PWMB  (1 unrouted)
N$1  (1 unrouted)
N$2  (1 unrouted)
N$3  (1 unrouted)
N$4  (1 unrouted)
N$5  (1 unrouted)
N$6  (1 unrouted)
N$7  (1 unrouted)
N$8  (1 unrouted)
N$9  (1 unrouted)
N$10  (1 unrouted)
N$11
  pour Top: 0,76.2 0,0 254,0 254,76.2
N$15  (1 unrouted)
N$16  (1 unrouted)
N$17  (1 unrouted)
N$18  (1 unrouted)
N$19  (1 unrouted)
N$20  (1 unrouted)
N$21  (1 unrouted)
N$22  (1 unrouted)
N$45  (1 unrouted)
N$46  (1 unrouted)
N$52  (1 unrouted)
N$54  (1 unrouted)
S1  (1 unrouted)
S2  (1 unrouted)
S_JOYB  (1 unrouted)
S_JOYH  (1 unrouted)
S_JOYV  (1 unrouted)
U1  (1 unrouted)
U2  (1 unrouted)
U3  (1 unrouted)
U4  (1 unrouted)
VMOT  (1 unrouted)

### Text on the board
Top: ***The TEENSY is on the BOTTOM side of the board; / / KNOBS and BUTTONS are on the TOP side of the board.